# Altium project H7_PCB.PrjPcb (part 2 of 2)

## Sheet Analog.SchDoc
size A3; Author: HamidFijani; DrawnBy: HamidFijani; SheetNumber: 11; SheetTotal: 13
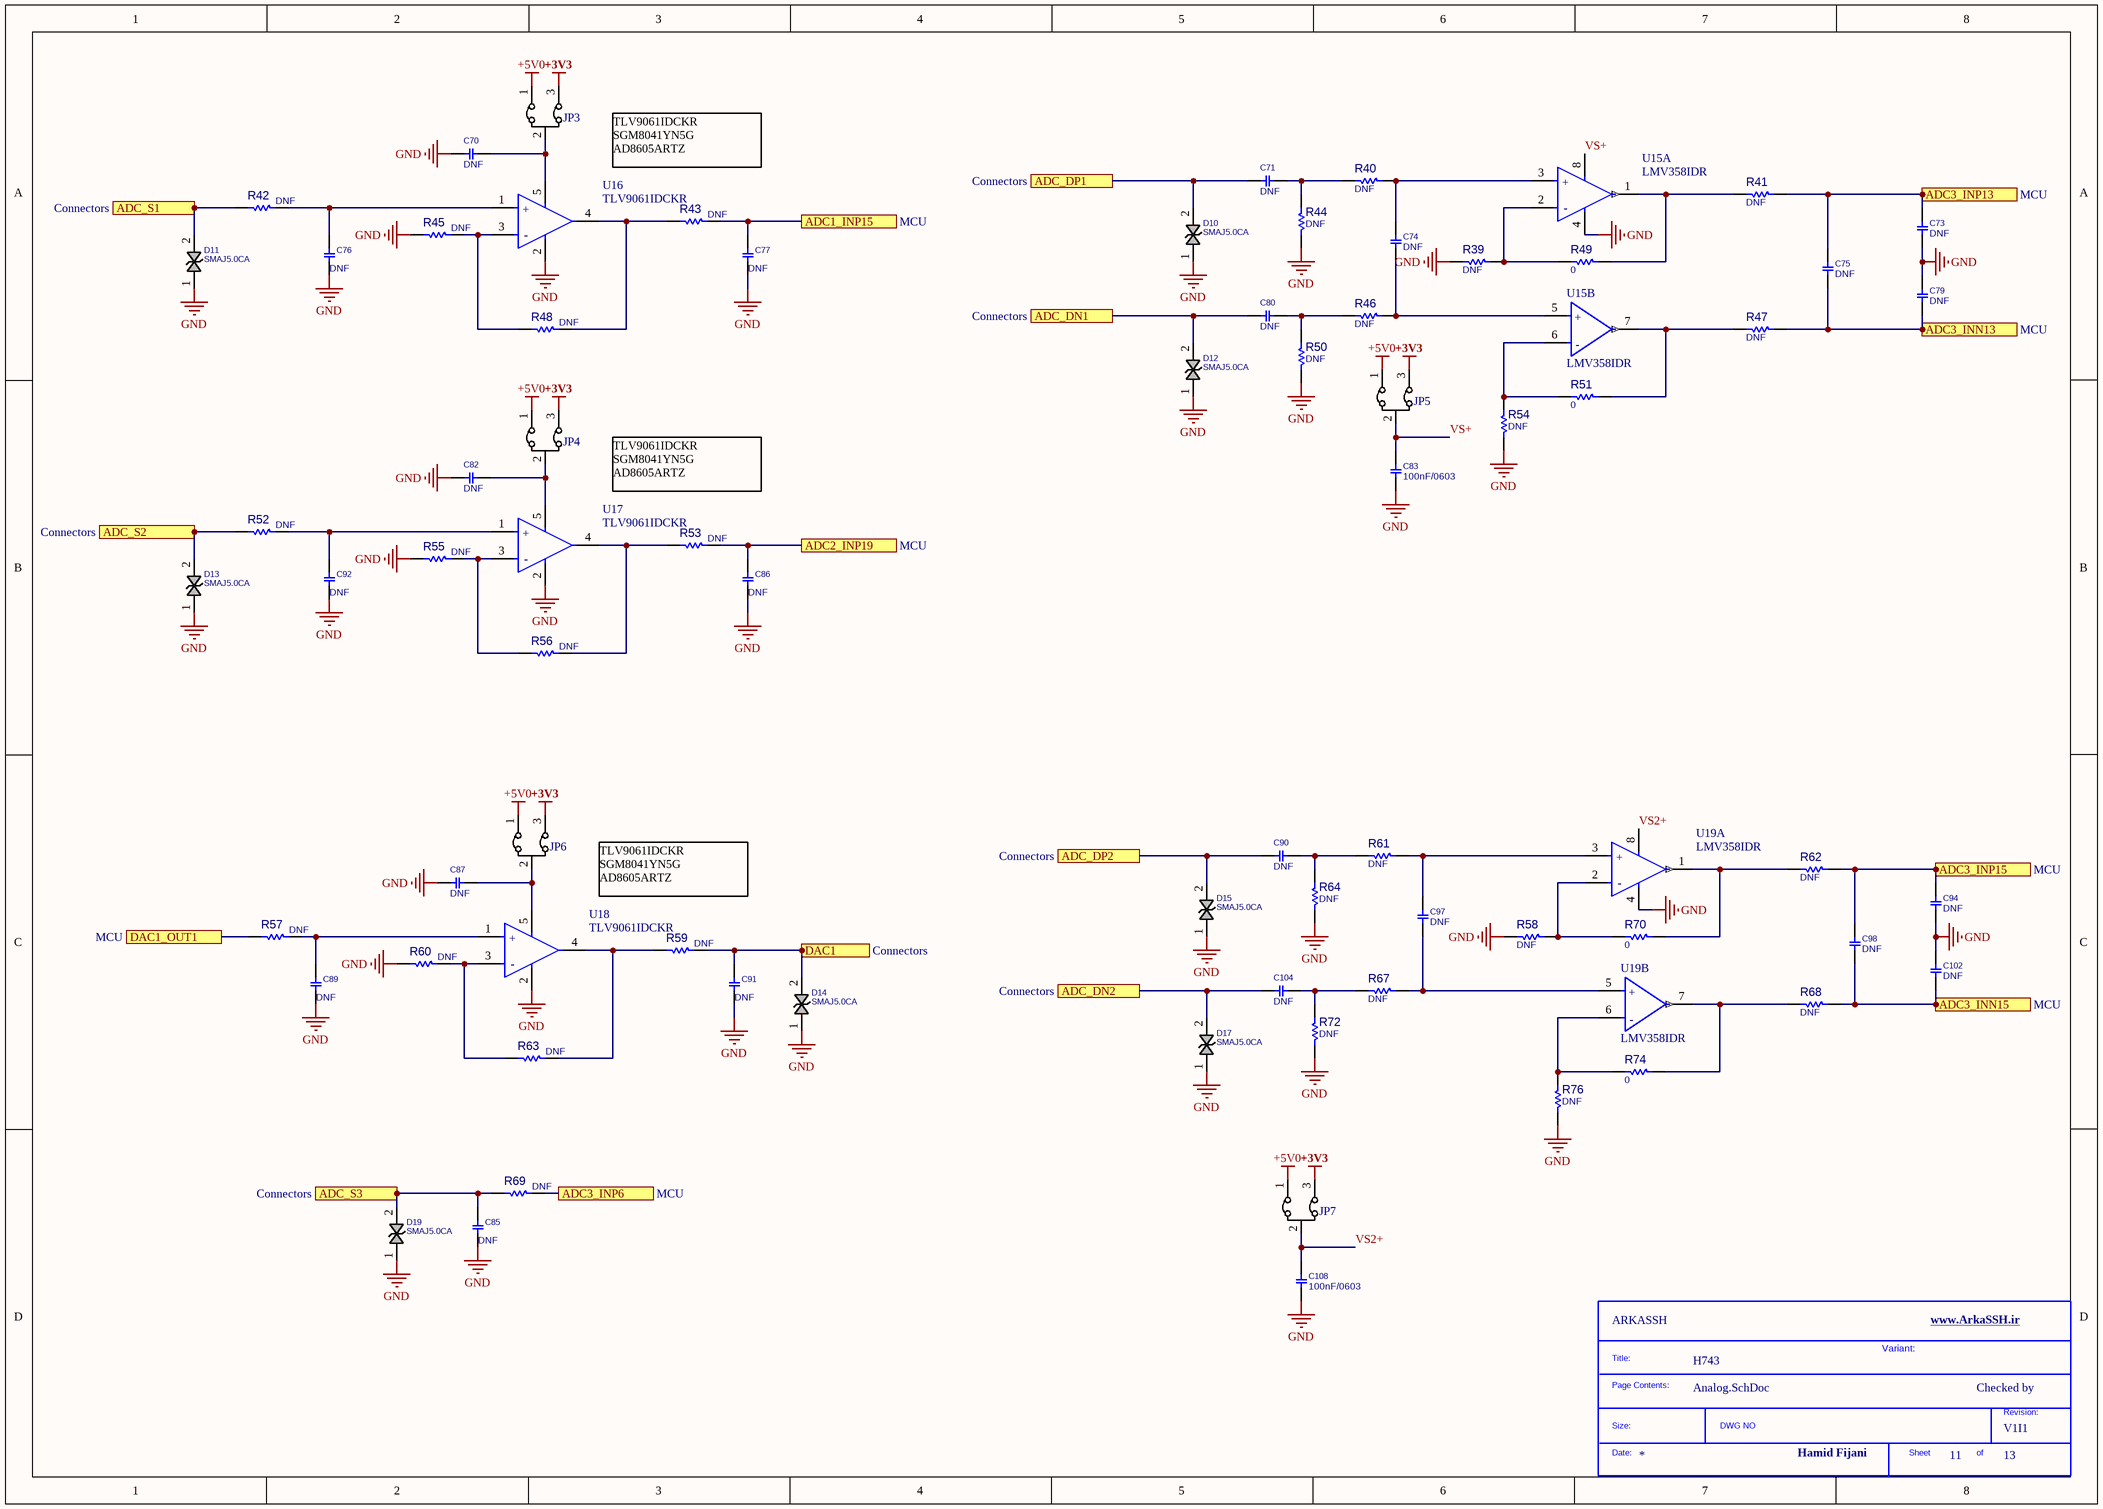
[diagram p11: Analog.SchDoc]

### Parts
(Parts that share a designator on the sheet are numbered #1, #2 ... from top to bottom, then left to right.)
?#7  (no value)  (graphical)
C70  DNF  [C0603]
C71  DNF  [C0603]
C73  DNF  [C0603]
C74  DNF  [C0603]
C75  DNF  [C0603]
C76  DNF  [C0603]
C77  DNF  [C0603]
C79  DNF  [C0603]
C80  DNF  [C0603]
C82  DNF  [C0603]
C83  100nF/0603  [C0603]
C85  DNF  [C0603]
C86  DNF  [C0603]
C87  DNF  [C0603]
C89  DNF  [C0603]
C90  DNF  [C0603]
C91  DNF  [C0603]
C92  DNF  [C0603]
C94  DNF  [C0603]
C97  DNF  [C0603]
C98  DNF  [C0603]
C102  DNF  [C0603]
C104  DNF  [C0603]
C108  100nF/0603  [C0603]
D10  SMAJ5.0CA  [D_SMA]
D11  SMAJ5.0CA  [D_SMA]
D12  SMAJ5.0CA  [D_SMA]
D13  SMAJ5.0CA  [D_SMA]
D14  SMAJ5.0CA  [D_SMA]
D15  SMAJ5.0CA  [D_SMA]
D17  SMAJ5.0CA  [D_SMA]
D19  SMAJ5.0CA  [D_SMA]
JP3  JMPHDR3PIN  [JP_3_40X90]  (value not drawn)  (no BOM)
JP4  JMPHDR3PIN  [JP_3_40X90]  (value not drawn)  (no BOM)
JP5  JMPHDR3PIN  [JP_3_40X90]  (value not drawn)  (no BOM)
JP6  JMPHDR3PIN  [JP_3_40X90]  (value not drawn)  (no BOM)
JP7  JMPHDR3PIN  [JP_3_40X90]  (value not drawn)  (no BOM)
R39  DNF  [R0603]
R40  DNF  [R0603]
R41  DNF  [R0603]
R42  DNF  [R0603]
R43  DNF  [R0603]
R44  DNF  [R0603]
R45  DNF  [R0603]
R46  DNF  [R0603]
R47  DNF  [R0603]
R48  DNF  [R0603]
R49  0  [R0603]
R50  DNF  [R0603]
R51  0  [R0603]
R52  DNF  [R0603]
R53  DNF  [R0603]
R54  DNF  [R0603]
R55  DNF  [R0603]
R56  DNF  [R0603]
R57  DNF  [R0603]
R58  DNF  [R0603]
R59  DNF  [R0603]
R60  DNF  [R0603]
R61  DNF  [R0603]
R62  DNF  [R0603]
R63  DNF  [R0603]
R64  DNF  [R0603]
R67  DNF  [R0603]
R68  DNF  [R0603]
R69  DNF  [R0603]
R70  0  [R0603]
R72  DNF  [R0603]
R74  0  [R0603]
R76  DNF  [R0603]
U15  LMV358IDR  [FP-D0008A-MFG]  (parts A,B of 2)
U16  TLV9061IDCKR  [FP-DCK0005A-MFG]
U17  TLV9061IDCKR  [FP-DCK0005A-MFG]
U18  TLV9061IDCKR  [FP-DCK0005A-MFG]
U19  LMV358IDR  [FP-D0008A-MFG]  (parts A,B of 2)

### Ports
ADC1_INP15 (see MCU), ADC2_INP19 (see MCU), ADC3_INN13 (see MCU), ADC3_INN15 (see MCU), ADC3_INP6 (see MCU), ADC3_INP13 (see MCU), ADC3_INP15 (see MCU), ADC_DN1 (see Connectors), ADC_DN2 (see Connectors), ADC_DP1 (see Connectors), ADC_DP2 (see Connectors), ADC_S1 (see Connectors), ADC_S2 (see Connectors), ADC_S3 (see Connectors), DAC1 (see Connectors), DAC1_OUT1 (see MCU)

### Nets
+3V3: JP3.3 JP4.3 JP5.3 JP6.3 JP7.3
+5V0: JP3.1 JP4.1 JP5.1 JP6.1 JP7.1
GND: C70.2 C73.2 C76.2 C77.2 C79.1 C82.2 C83.2 C85.2 C86.2 C87.2 C89.2 C91.2 C92.2 C94.2 C102.1 C108.2 D10.1 D11.1 D12.1 D13.1 D14.1 D15.1 D17.1 D19.1 R39.2 R44.1 R45.1 R50.1 R54.2 R55.1 R58.2 R60.1 R64.1 R72.1 R76.2 U15.4(GND) U16.2(V-) U17.2(V-) U18.2(V-) U19.4(GND)
VS2+: C108.1 JP7.2 U19.8(VCC+)
VS+: C83.1 JP5.2 U15.8(VCC+)
NetC70_1: C70.1 JP3.2 U16.5(V+)
NetC71_1: C71.1 D10.2 ; port ADC_DP1
NetC71_2: C71.2 R40.1 R44.2
NetC73_1: C73.1 C75.1 R41.2 ; port ADC3_INP13
NetC74_1: C74.1 R40.2 U15.3(1IN+)
NetC74_2: C74.2 R46.2 U15.5(2IN+)
NetC75_2: C75.2 C79.2 R47.2 ; port ADC3_INN13
NetC76_1: C76.1 R42.2 U16.1(IN+)
NetC77_1: C77.1 R43.2 ; port ADC1_INP15
NetC80_1: C80.1 D12.2 ; port ADC_DN1
NetC80_2: C80.2 R46.1 R50.2
NetC82_1: C82.1 JP4.2 U17.5(V+)
NetC85_1: C85.1 D19.2 R69.1 ; port ADC_S3
NetC86_1: C86.1 R53.2 ; port ADC2_INP19
NetC87_1: C87.1 JP6.2 U18.5(V+)
NetC89_1: C89.1 R57.2 U18.1(IN+)
NetC90_1: C90.1 D15.2 ; port ADC_DP2
NetC90_2: C90.2 R61.1 R64.2
NetC91_1: C91.1 D14.2 R59.2 ; port DAC1
NetC92_1: C92.1 R52.2 U17.1(IN+)
NetC94_1: C94.1 C98.1 R62.2 ; port ADC3_INP15
NetC97_1: C97.1 R61.2 U19.3(1IN+)
NetC97_2: C97.2 R67.2 U19.5(2IN+)
NetC98_2: C98.2 C102.2 R68.2 ; port ADC3_INN15
NetC104_1: C104.1 D17.2 ; port ADC_DN2
NetC104_2: C104.2 R67.1 R72.2
NetD11_2: D11.2 R42.1 ; port ADC_S1
NetD13_2: D13.2 R52.1 ; port ADC_S2
NetR39_1: R39.1 R49.2 U15.2(1IN-)
NetR41_1: R41.1 R49.1 U15.1(OUT)
NetR43_1: R43.1 R48.2 U16.4(OUT)
NetR45_2: R45.2 R48.1 U16.3(IN-)
NetR47_1: R47.1 R51.1 U15.7(2OUT)
NetR51_2: R51.2 R54.1 U15.6(2IN-)
NetR53_1: R53.1 R56.2 U17.4(OUT)
NetR55_2: R55.2 R56.1 U17.3(IN-)
NetR57_1: R57.1 ; port DAC1_OUT1
NetR58_1: R58.1 R70.2 U19.2(1IN-)
NetR59_1: R59.1 R63.2 U18.4(OUT)
NetR60_2: R60.2 R63.1 U18.3(IN-)
NetR62_1: R62.1 R70.1 U19.1(OUT)
NetR68_1: R68.1 R74.1 U19.7(2OUT)
NetR69_2: R69.2 ; port ADC3_INP6
NetR74_2: R74.2 R76.1 U19.6(2IN-)

### Notes on the sheet
- TLV9061IDCKR
  SGM8041YN5G
  AD8605ARTZ
- Title:
- Page Contents:
- Variant:
- Checked by
- Size:
- Date:
- DWG NO
- Sheet
- of
- Revision:
- (in symbol CMP-04895-000108-1) +; -
- (in symbol CMP-04895-000136-1, part A) +; -
- (in symbol CMP-04895-000136-1, part B) +; -

### Library data of the parts
?#7 = SDTitleBlock
C70 C71 C73-C77 C79 C80 C82 C83 C85-C87 C89-C92 C94 C97 C98 C102 C104 C108 = CAP_SMD_MLCC_0603: CAP, MLCC; PARAM: -, -%; MANF_P#: MANF_PART#; PARAM2: -V; PRICE: 100= 1$; MANF: -; ASSEMBLY: ASSEMBLY
  C70 C71 C73-C77 C79 C80 C82 C85-C87 C89-C92 C94 C97 C98 C102 C104: VALUE: DNF
  C83 C108: VALUE: 100nF/0603
D10-D15 D17 D19 = TVS_SMAJ5CA: TVS, ESD PROTECT, Bidirectional; MANF: Littelfuse; PARAM2: 5VR, 6.74VBR; PARAM: -65~150°C; MANF_P#: SMAJ5CA; PRICE: 0.5t@Paya; VALUE: SMAJ5.0CA
JP3-JP7 = JUMPER_SOLDER_3P: JUMPER, HEADER 3PIN; MANF: MANF; MANF_P#: MANF_P#; VALUE: JMPHDR3PIN
R39-R64 R67-R70 R72 R74 R76 = RES_SMD_0603: RESISTOR, SMD; PARAM: 1%, 0.1W; DESC: DESCRIPTION; DIST#: MOUSER; MANF_P#: -; MANF: -; ASSEMBLY: ASSEMBLY; PRICE: -; PARAM2: -
  R39-R48 R50 R52-R64 R67-R69 R72 R76: VALUE: DNF
  R49 R51 R70 R74: VALUE: 0
U15 U19 = CMP-04895-000136-1: IC OPAMP GP 2 CIRCUIT 8SOIC; Number of Elements: 2; Min Supply Voltage: 2.7V; Input Bias Current: 250nA; Output Current per Channel: 160mA; Bandwidth: 1MHz; Voltage Gain: 100dB; Input Offset Voltage (Vos): 7mV; Slew Rate: 1V/µs; Nominal Supply Current: 440uA; Power Supply Rejection Ratio (PSRR): 50dB; Max Supply Voltage: 5.5V; Operating Supply Current: 210uA; Lead Free: Lead Free; Length: 4.9mm; RoHS Compliant: Yes; REACH SVHC: No SVHC; Case/Package: SOIC; Height: 1.58mm; Number of Channels: 2; Number of Amplifiers: 2; Radiation Hardening: No; Number of Circuits: 2; Mount: Surface Mount; Contact Plating: Gold; Unity Gain Bandwidth Product: 1MHz; Min Operating Temperature: -40°C; Max Operating Temperature: 125°C; Width: 3.91mm; Gain Bandwidth Product: 1MHz; Number of Pins: 8; Packaging: Tape and Reel; Package Quantity: 2500; Output Current: 160mA; Common Mode Rejection Ratio: 50dB
U16-U18 = CMP-04895-000108-1: IC CMOS 1 CIRCUIT SC70-5; RoHS Compliant: Yes

## Sheet Connectors.SchDoc
size A3; Author: HamidFijani; DrawnBy: HamidFijani; SheetNumber: 12; SheetTotal: 13
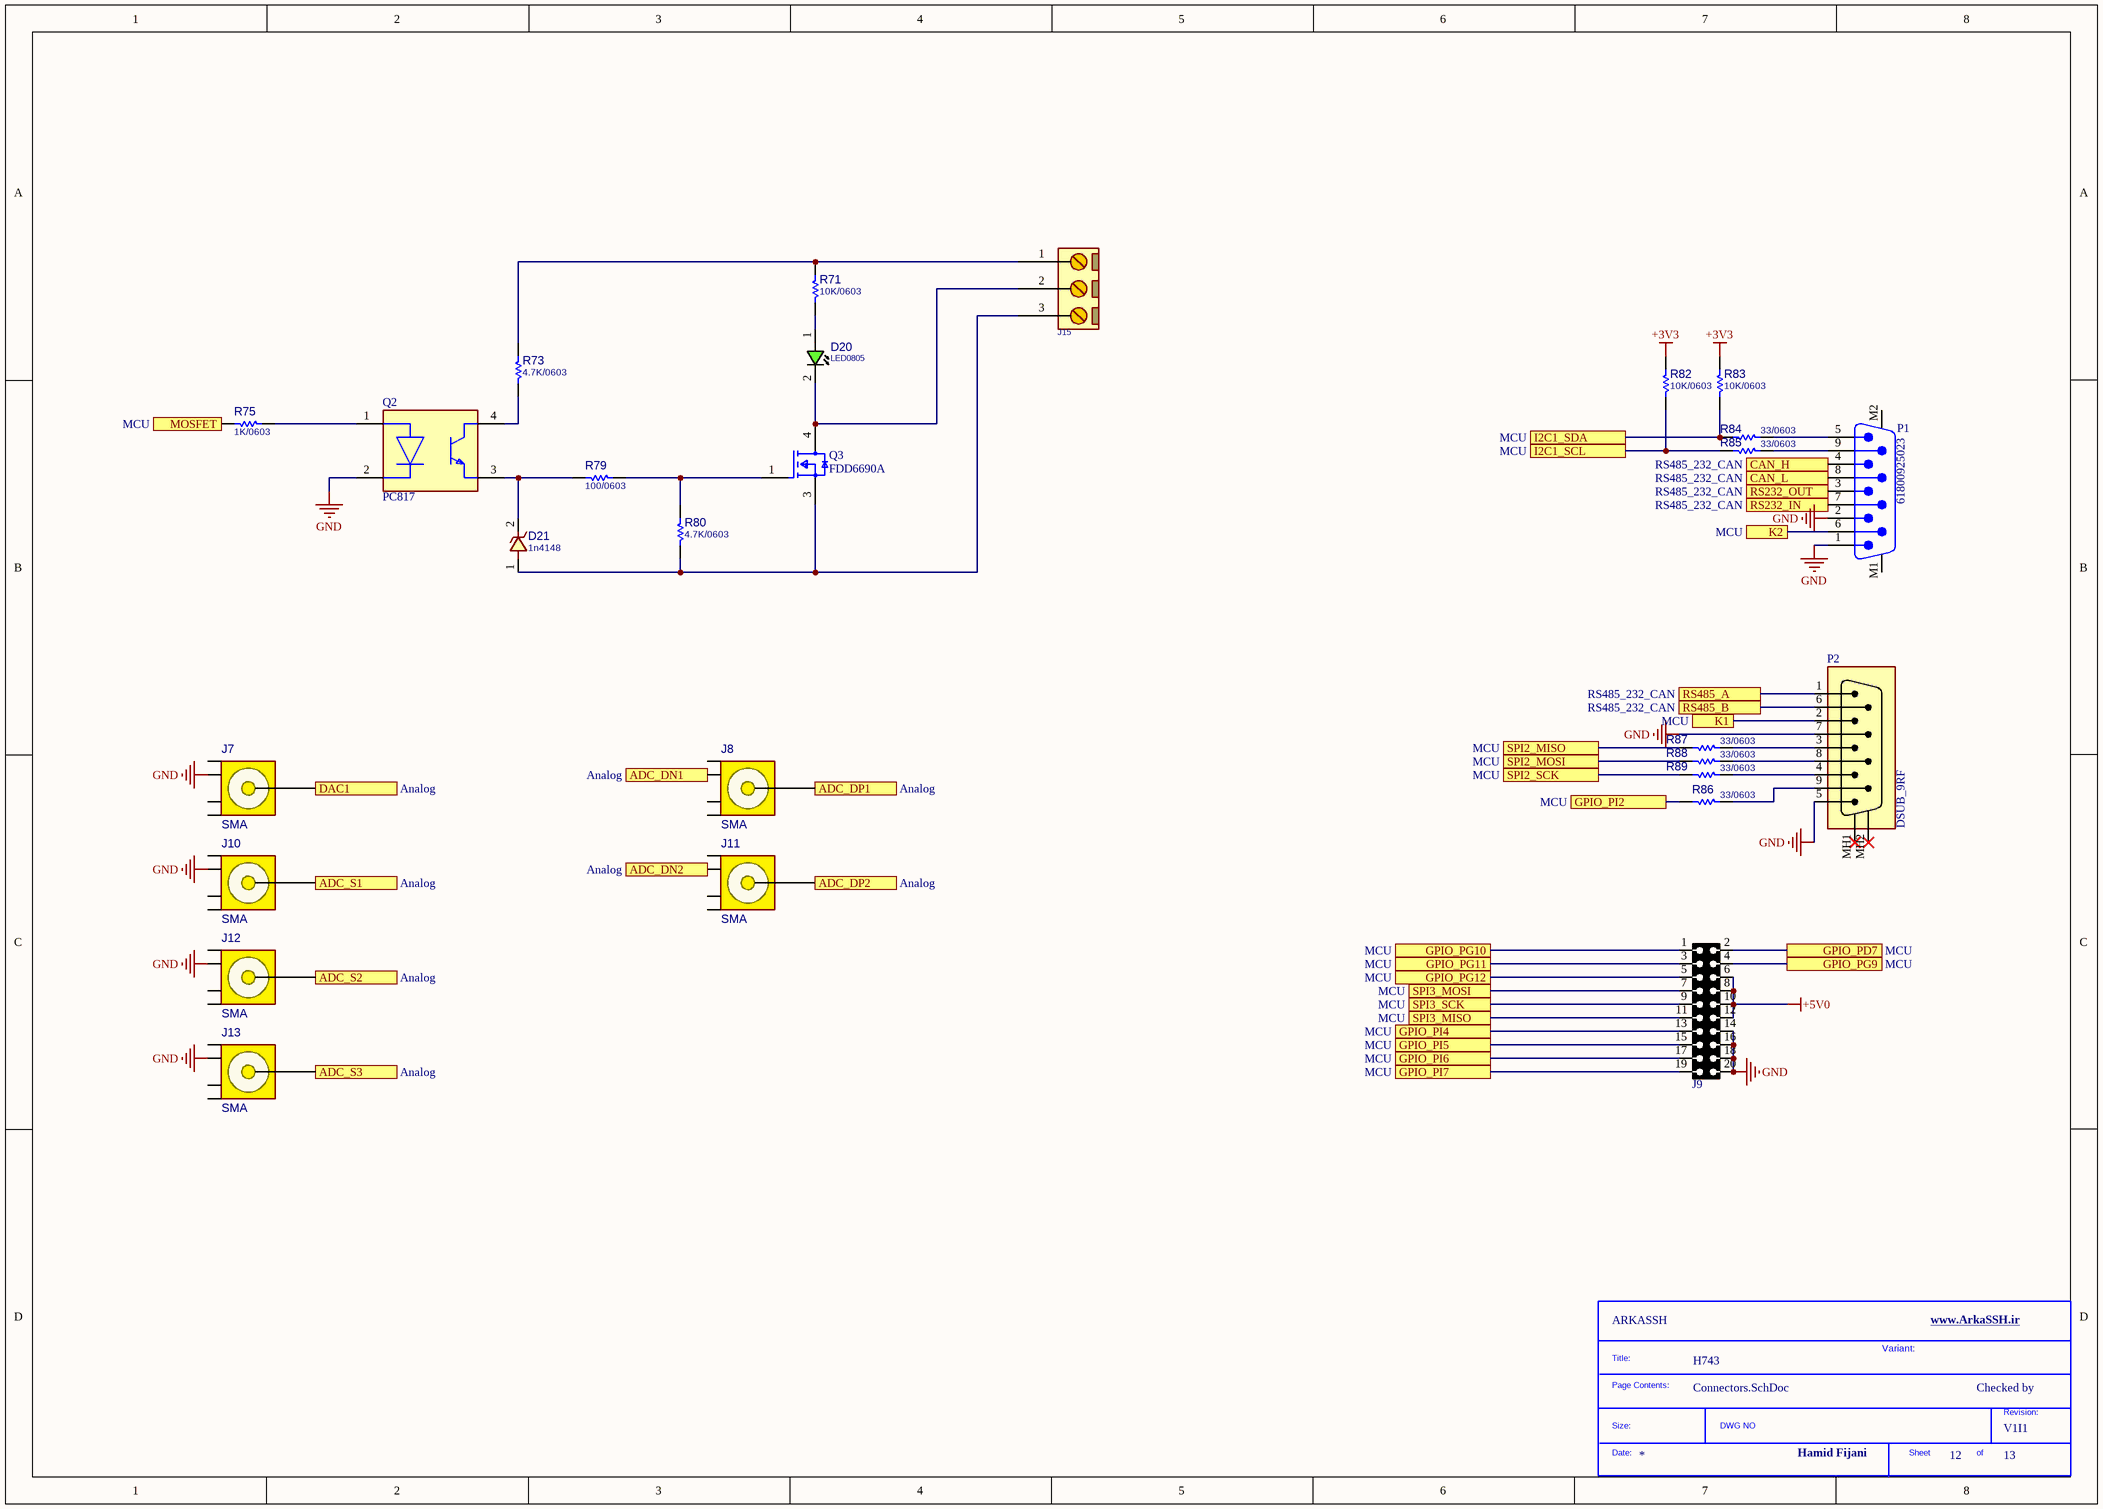
[diagram p12: Connectors.SchDoc]

### Parts
(Parts that share a designator on the sheet are numbered #1, #2 ... from top to bottom, then left to right.)
?#8  (no value)  (graphical)
D20  LED0805  [LED0805]
D21  1n4148  [D_SOD123W]
J7  SMA  [SMA_RA]
J8  SMA  [SMA_ST]
J9  HDRMINI_2X10  [HDRMINI_F_2X10]  (value not drawn)
J10  SMA  [SMA_RA]
J11  SMA  [SMA_RA]
J12  SMA  [SMA_ST]
J13  SMA  [SMA_ST]
J15  CONN_TB3  [MSTB_3]  (value not drawn)
P1  61800925023  [61800925023]
P2  DSUB_9RF  [DSUB_9RF]
Q2  PC817  [FP-PC817XNNIP0F-MFG]
Q3  FDD6690A  [FP-369AS-MFG]
R71  10K/0603  [R0603]
R73  4.7K/0603  [R0603]
R75  1K/0603  [R0603]
R79  100/0603  [R0603]
R80  4.7K/0603  [R0603]
R82  10K/0603  [R0603]
R83  10K/0603  [R0603]
R84  33/0603  [R0603]
R85  33/0603  [R0603]
R86  33/0603  [R0603]
R87  33/0603  [R0603]
R88  33/0603  [R0603]
R89  33/0603  [R0603]

### Ports
ADC_DN1 (see Analog), ADC_DN2 (see Analog), ADC_DP1 (see Analog), ADC_DP2 (see Analog), ADC_S1 (see Analog), ADC_S2 (see Analog), ADC_S3 (see Analog), CAN_H (see RS485_232_CAN), CAN_L (see RS485_232_CAN), DAC1 (see Analog), GPIO_PD7 (see MCU), GPIO_PG9 (see MCU), GPIO_PG10 (see MCU), GPIO_PG11 (see MCU), GPIO_PG12 (see MCU), GPIO_PI2 (see MCU), GPIO_PI4 (see MCU), GPIO_PI5 (see MCU), GPIO_PI6 (see MCU), GPIO_PI7 (see MCU), I2C1_SCL (see MCU), I2C1_SDA (see MCU), K1 (see MCU), K2 (see MCU), MOSFET (see MCU), RS232_IN (see RS485_232_CAN), RS232_OUT (see RS485_232_CAN), RS485_A (see RS485_232_CAN), RS485_B (see RS485_232_CAN), SPI2_MISO (see MCU), SPI2_MOSI (see MCU), SPI2_SCK (see MCU), SPI3_MISO (see MCU), SPI3_MOSI (see MCU), SPI3_SCK (see MCU)

### Nets
+3V3: R82.1 R83.1
+5V0: J9.6 J9.8 J9.10 J9.12
GND: J7.3(G2) J9.14 J9.16 J9.18 J9.20 J10.3(G2) J12.3(G2) J13.3(G2) P1.1 P1.2 P2.5 P2.7 Q2.2(C)
NetC71_1: J8.1(SIG) ; port ADC_DP1
NetC80_1: J8.3(G2) ; port ADC_DN1
NetC85_1: J13.1(SIG) ; port ADC_S3
NetC90_1: J11.1(SIG) ; port ADC_DP2
NetC91_1: J7.1(SIG) ; port DAC1
NetC104_1: J11.3(G2) ; port ADC_DN2
NetC111_2: P1.6 ; port K2
NetC112_2: P2.2 ; port K1
NetD6_1: P1.3 ; port RS232_OUT
NetD6_2: P1.7 ; port RS232_IN
NetD9_1: P1.4 ; port CAN_H
NetD9_2: P1.8 ; port CAN_L
NetD11_2: J10.1(SIG) ; port ADC_S1
NetD13_2: J12.1(SIG) ; port ADC_S2
NetD20_1: D20.1(ANODE) R71.2
NetD20_2: D20.2(CATHODE) J15.2 Q3.4(D)
NetD21_1: D21.1 J15.3 Q3.3(S) R80.2
NetD21_2: D21.2 Q2.3(E) R79.2
NetJ9_1: J9.1 ; port GPIO_PG10
NetJ9_2: J9.2 ; port GPIO_PD7
NetJ9_3: J9.3 ; port GPIO_PG11
NetJ9_4: J9.4 ; port GPIO_PG9
NetJ9_5: J9.5 ; port GPIO_PG12
NetJ9_7: J9.7 ; port SPI3_MOSI
NetJ9_9: J9.9 ; port SPI3_SCK
NetJ9_11: J9.11 ; port SPI3_MISO
NetJ9_13: J9.13 ; port GPIO_PI4
NetJ9_15: J9.15 ; port GPIO_PI5
NetJ9_17: J9.17 ; port GPIO_PI6
NetJ9_19: J9.19 ; port GPIO_PI7
NetJ15_1: J15.1 R71.1 R73.1
NetP1_5: P1.5 R84.2
NetP1_9: P1.9 R85.2
NetP2_1: P2.1 ; port RS485_A
NetP2_3: P2.3 R87.2
NetP2_4: P2.4 R89.2
NetP2_6: P2.6 ; port RS485_B
NetP2_8: P2.8 R88.2
NetP2_9: P2.9 R86.2
NetQ2_1: Q2.1(A) R75.1
NetQ2_4: Q2.4(C) R73.2
NetQ3_1: Q3.1(G) R79.1 R80.1
NetR75_2: R75.2 ; port MOSFET
NetR82_2: R82.2 R85.1 ; port I2C1_SCL
NetR83_2: R83.2 R84.1 ; port I2C1_SDA
NetR86_1: R86.1 ; port GPIO_PI2
NetR87_1: R87.1 ; port SPI2_MISO
NetR88_1: R88.1 ; port SPI2_MOSI
NetR89_1: R89.1 ; port SPI2_SCK

Not connected (* = marked no-connect by the designer): J7 2(G1) 4(G3) 5(G4); J8 2(G1) 4(G3) 5(G4); J10 2(G1) 4(G3) 5(G4); J11 2(G1) 4(G3) 5(G4); J12 2(G1) 4(G3) 5(G4); J13 2(G1) 4(G3) 5(G4); P1 M1 M2; P2 MH1* MH2*

### Notes on the sheet
- Title:
- Page Contents:
- Variant:
- Checked by
- Size:
- Date:
- DWG NO
- Sheet
- of
- Revision:

### Library data of the parts
?#8 = SDTitleBlock
D20 = LED_SMD_0805: LED, SMD, 0805; DESC: DESCRIPTION; MANF_P#: MANF_PART#; PARAM2: 2.2V; MANF: MANF; ASSEMBLY: ASSEMBLY; PRICE: PRICE; VALUE: LED0805
D21 = DIODE_SMD_ZENER_DFLZ5V6: DIODE, ZENER, 1W, 5.1V; MANF: Diodes; DESC: DESCRIPTION; PARAM2: 1W, 4Ohm, -55~150oC; PARAM: 5.6V; MANF_P#: DFLZ5V6-7; ASSEMBLY: ASSEMBLY; PRICE: 0.5$; VALUE: 1n4148
J7 J10 J11 = CONN_RF_SMA_RA: CONN, RF, SMA, Right Angle; MANF_P#: SMA-J-P-H-RA-TH1; MANF: Samtec; PARAM: 50Ohm, 20GHz; DESC: DESCRIPTION; DIST#: DIGIKEY; PARAM2: GOLD; ASSEMBLY: ASSEMBLY; PRICE: 6.3$; VALUE: SMA
J8 J12 J13 = CONN_RF_SMA_ST: CONN, RF, SMA, STRAIGHT; MANF_P#: 142-0701-201; MANF: Johnson; PARAM: 50Ohm, 18GHz; DESC: DESCRIPTION; DIST#: MOUSER; PARAM2: GOLD; ASSEMBLY: ASSEMBLY; PRICE: 2.7$; VALUE: SMA
J9 = HDRMINI_F_2X10: CONN, HEADER, Female, pitch: 1.27mm,; VALUE: HDRMINI_2X10
J15 = CONN_MSTB_3: CONN, PHOENIX MSTB, 5-G, 5.08mm pitch; PARAM2: 320V; PARAM: 12A; VALUE: CONN_TB3
P1 = CMP-1502-00276-2: NexarPartId: 18818192; Pitch: 2.84mm; Current Rating: 3A; Operating Supply Voltage: 125V; Insulation Resistance: 5GΩ; Number of Contacts: 9; Gender: Male; Contact Resistance: 30mΩ; Connector Type: D-Sub; REACH SVHC: Unknown; Min Operating Temperature: -40°C; Mount: Through Hole; Width: 12.5mm; Number of Rows: 2; Number of Pins: 9; RoHS: Compliant; Housing Material: Steel; Depth: 10.9mm; Orientation: Vertical; Contact Plating: Gold; Length: 30.81mm; Insulation Material: PBT; Max Operating Temperature: 85°C; Voltage Rating: 125V; Termination: SMD/SMT
P2 = CONN_DSUB_9RF: CONN, DSUB, HD, 9PIN, R/A, FEMALE, THD; MANF_P#: -; MANF: -; VALUE: DSUB_9RF
Q2 = CMP-65434-000005-1: OPTOISOLATOR 5KV TRANS 4SMD; Reverse Breakdown Voltage: 6V; Output Current per Channel: 30mA; Power Dissipation: 200mW; Collector-emitter Voltage-Max: 200mV; Max Output Voltage: 80V; Input Current: 50mA; Forward Voltage: 1.4V; Fall Time: 18000ns; Number of Elements: 1; Input Type: DC; Packaging: Tape and Reel; RoHS Compliant: Yes; Contact Plating: Copper; Min Operating Temperature: -30°C; Collector Emitter Saturation Voltage: 200mV; Max Input Current: 50mA; Radiation Hardening: No; Max Collector Current: 50mA; Case/Package: SMD/SMT; Mount: Surface Mount; Output Voltage: 80V; Forward Current: 50mA; Max Power Dissipation: 200mW; Collector Emitter Voltage (VCEO): 80V; Number of Channels: 1; Rise Time: 18000ns; Isolation Voltage: 5kV; Number of Pins: 4; Lead Free: Lead Free; Package Quantity: 2000; Isolation Voltage-Max: 5kV; Max Operating Temperature: 100°C
Q3 = CMP-00278-84325831-1: FDD6690A N-Channel PowerTrench® MOSFET, 30V, 46A, 12mΩ; Manufacturer Lifecycle Status: LAST SHIPMENTS; Turn-Off Delay Time: 29ns; Turn-On Delay Time: 10ns; Input Capacitance: 1.23nF; Nominal Vgs: 1.9V; Rise Time: 7ns; Element Configuration: Single; Power Dissipation: 3.3W; Fall Time: 12ns; Gate to Source Voltage (Vgs): 20V; Number of Elements: 1; Max Power Dissipation: 1.5W; Drain to Source Breakdown Voltage: 30V; Lifecycle Status: EOL; NexarPartId: 84325831; Weight: 260.37mg; Mount: Surface Mount; Number of Pins: 3; Rds On Max: 12mΩ; Radiation Hardening: No; Threshold Voltage: 1.9V; Min Operating Temperature: -55°C; Max Operating Temperature: 175°C; Resistance: 12MΩ; Voltage Rating (DC): 30V; REACH SVHC: No SVHC; Case/Package: TO-252; Width: 6.22mm; Current Rating: 46A; Length: 6.73mm; Height: 2.39mm; RoHS: Compliant; Drain to Source Voltage (Vdss): 30V; Lead Free: Lead Free; Packaging: Cut Tape; Drain to Source Resistance: 12mΩ; Continuous Drain Current (ID): 46A; Dual Supply Voltage: 30V
R71 R73 R75 R79 R80 R82-R89 = RES_SMD_0603: as R39 on sheet Analog; MANF_P#: -; MANF: -; ASSEMBLY: ASSEMBLY; PRICE: -; PARAM2: -
  R71 R82 R83: VALUE: 10K/0603
  R73 R80: VALUE: 4.7K/0603
  R75: VALUE: 1K/0603
  R79: VALUE: 100/0603
  R84-R89: VALUE: 33/0603

## Nets that join several sheets
+3V3: MCU (35 pins), Designator (6 pins), Designator (6 pins), MEMORY (14 pins), LAN (9 pins), SDCARD (9 pins), RS485_232_CAN (6 pins), Analog (5 pins), Connectors (R82.1 R83.1)
+5V0: MCU (C30.2 U2.3 U2.4), Designator (6 pins), Designator (6 pins), USB (F2.1 R28.1), RS485_232_CAN (JP1.1 JP2.1), Analog (5 pins), Connectors (J9.6 J9.8 J9.10 J9.12)
+VIN: Designator (D1_Designator#1.1 J14_Designator#1.2), Designator (D1_Designator#2.1 J14_Designator#2.2)
ETH_GND: LAN (J2.8 J2.SH1 J2.SH2), USB (J4.Shell J5.Shell)
GND: MCU (51 pins), Designator (10 pins), Designator (10 pins), MEMORY (15 pins), LAN (18 pins), SDCARD (7 pins), USB (13 pins), RS485_232_CAN (15 pins), Analog (40 pins), Connectors (13 pins)
DUSB1_N: MCU (U1.122), USB (L4.1)
DUSB1_P: MCU (U1.123), USB (L4.4)
NetC71_1: Analog (C71.1 D10.2), Connectors (J8.1)
NetC73_1: MCU (U1.43), Analog (C73.1 C75.1 R41.2)
NetC75_2: MCU (U1.44), Analog (C75.2 C79.2 R47.2)
NetC77_1: MCU (U1.47), Analog (C77.1 R43.2)
NetC80_1: Analog (C80.1 D12.2), Connectors (J8.3)
NetC85_1: Analog (C85.1 D19.2 R69.1), Connectors (J13.1)
NetC86_1: MCU (U1.51), Analog (C86.1 R53.2)
NetC90_1: Analog (C90.1 D15.2), Connectors (J11.1)
NetC91_1: Analog (C91.1 D14.2 R59.2), Connectors (J7.1)
NetC94_1: MCU (U1.45), Analog (C94.1 C98.1 R62.2)
NetC98_2: MCU (U1.46), Analog (C98.2 C102.2 R68.2)
NetC104_1: Analog (C104.1 D17.2), Connectors (J11.3)
NetC111_2: MCU (C111.2 R65.2 R77.1 SW1.2), Connectors (P1.6)
NetC112_2: MCU (C112.2 R66.2 R78.1 SW2.2), Connectors (P2.2)
NetD6_1: RS485_232_CAN (D6.1 D8.2 U13.7), Connectors (P1.3)
NetD6_2: RS485_232_CAN (D6.2 D7.2 U13.8), Connectors (P1.7)
NetD9_1: RS485_232_CAN (D9.1 R38.2 U14.7), Connectors (P1.4)
NetD9_2: RS485_232_CAN (D9.2 R38.1 U14.6), Connectors (P1.8)
NetD11_2: Analog (D11.2 R42.1), Connectors (J10.1)
NetD13_2: Analog (D13.2 R52.1), Connectors (J12.1)
NetJ9_1: MCU (U1.153), Connectors (J9.1)
NetJ9_2: MCU (U1.151), Connectors (J9.2)
NetJ9_3: MCU (U1.154), Connectors (J9.3)
NetJ9_4: MCU (U1.152), Connectors (J9.4)
NetJ9_5: MCU (U1.155), Connectors (J9.5)
NetJ9_7: MCU (U1.150), Connectors (J9.7)
NetJ9_9: MCU (U1.161), Connectors (J9.9)
NetJ9_11: MCU (U1.162), Connectors (J9.11)
NetJ9_13: MCU (U1.173), Connectors (J9.13)
NetJ9_15: MCU (U1.174), Connectors (J9.15)
NetJ9_17: MCU (U1.175), Connectors (J9.17)
NetJ9_19: MCU (U1.176), Connectors (J9.19)
NetP2_1: RS485_232_CAN (R33.2 R35.1 U11.6 U12.2), Connectors (P2.1)
NetP2_6: RS485_232_CAN (R35.2 R37.1 U11.7 U12.1), Connectors (P2.6)
NetR8_2: MCU (U1.79), LAN (R8.2 U3.15)
NetR9_1: MCU (U1.42), LAN (R9.1)
NetR27_2: MCU (U1.34), MEMORY (R27.2 U6.19)
NetR29_1: MCU (U1.57), USB (R29.1)
NetR31_2: MCU (U1.121), USB (R31.2)
NetR32_2: MCU (U1.120), USB (R32.2)
NetR34_2: MCU (U1.116), RS485_232_CAN (R34.2 U11.1)
NetR36_2: MCU (U1.119), RS485_232_CAN (R36.2 U11.2 U11.3)
NetR57_1: MCU (U1.50), Analog (R57.1)
NetR69_2: MCU (U1.28), Analog (R69.2)
NetR75_2: MCU (U1.89), Connectors (R75.2)
NetR82_2: MCU (U1.167), Connectors (R82.2 R85.1)
NetR83_2: MCU (U1.165), Connectors (R83.2 R84.1)
NetR86_1: MCU (U1.133), Connectors (R86.1)
NetR87_1: MCU (U1.94), Connectors (R87.1)
NetR88_1: MCU (U1.95), Connectors (R88.1)
NetR89_1: MCU (U1.132), Connectors (R89.1)
NetU1_16: MCU (U1.16), MEMORY (U6.23)
NetU1_17: MCU (U1.17), MEMORY (U6.24)
NetU1_18: MCU (U1.18), MEMORY (U6.25)
NetU1_19: MCU (U1.19), MEMORY (U6.26)
NetU1_20: MCU (U1.20), MEMORY (U6.29)
NetU1_21: MCU (U1.21), MEMORY (U6.30)
NetU1_24: MCU (U1.24), MEMORY (U7.7)
NetU1_25: MCU (U1.25), MEMORY (U7.3)
NetU1_26: MCU (U1.26), MEMORY (U7.5)
NetU1_27: MCU (U1.27), MEMORY (U7.2)
NetU1_32: MCU (U1.32), MEMORY (U6.16)
NetU1_33: MCU (U1.33), LAN (U3.13)
NetU1_35: MCU (U1.35), MEMORY (U6.37)
NetU1_58: MCU (U1.58), MEMORY (U7.6)
NetU1_59: MCU (U1.59), MEMORY (U6.18)
NetU1_60: MCU (U1.60), MEMORY (U6.31)
NetU1_63: MCU (U1.63), MEMORY (U6.32)
NetU1_64: MCU (U1.64), MEMORY (U6.33)
NetU1_65: MCU (U1.65), MEMORY (U6.34)
NetU1_66: MCU (U1.66), MEMORY (U6.22)
NetU1_67: MCU (U1.67), MEMORY (U6.35)
NetU1_68: MCU (U1.68), MEMORY (U6.8)
NetU1_69: MCU (U1.69), MEMORY (U6.10)
NetU1_70: MCU (U1.70), MEMORY (U6.11)
NetU1_73: MCU (U1.73), MEMORY (U6.13)
NetU1_74: MCU (U1.74), MEMORY (U6.42)
NetU1_75: MCU (U1.75), MEMORY (U6.44)
NetU1_76: MCU (U1.76), MEMORY (U6.45)
NetU1_77: MCU (U1.77), MEMORY (U6.47)
NetU1_78: MCU (U1.78), MEMORY (U6.48)
NetU1_92: MCU (U1.92), RS485_232_CAN (U14.4)
NetU1_93: MCU (U1.93), RS485_232_CAN (U14.1)
NetU1_96: MCU (U1.96), MEMORY (U6.50)
NetU1_97: MCU (U1.97), MEMORY (U6.51)
NetU1_98: MCU (U1.98), MEMORY (U6.53)
NetU1_104: MCU (U1.104), MEMORY (U6.2)
NetU1_105: MCU (U1.105), MEMORY (U6.4)
NetU1_106: MCU (U1.106), MEMORY (U6.36)
NetU1_108: MCU (U1.108), MEMORY (U6.20)
NetU1_109: MCU (U1.109), MEMORY (U6.21)
NetU1_112: MCU (U1.112), MEMORY (U6.38)
NetU1_115: MCU (U1.115), RS485_232_CAN (U11.4)
NetU1_128: MCU (U1.128), RS485_232_CAN (U13.10)
NetU1_129: MCU (U1.129), RS485_232_CAN (U13.9)
NetU1_142: MCU (U1.142), MEMORY (U6.5)
NetU1_143: MCU (U1.143), MEMORY (U6.7)
NetU1_160: MCU (U1.160), MEMORY (U6.17)
NetU1_164: MCU (U1.164), MEMORY (U7.1)
NetU1_169: MCU (U1.169), MEMORY (U6.15)
NetU1_170: MCU (U1.170), MEMORY (U6.39)
RMII_CRS_DV: MCU (U1.53), LAN (RA1.2 U3.11)
RMII_REF_CLK: MCU (U1.41), LAN (R81.1 RA1.1)
RMII_RXD0: MCU (U1.54), LAN (RA1.3 U3.8)
RMII_RXD1: MCU (U1.55), LAN (RA1.4 U3.7)
RMII_TX_EN: MCU (U1.80), LAN (U3.16)
RMII_TXD0: MCU (U1.156), LAN (U3.17)
RMII_TXD1: MCU (U1.157), LAN (U3.18)
SD_CMD: MCU (U1.144), SDCARD (R26.1)
SD_D0: MCU (U1.117), SDCARD (R22.1)
SD_D1: MCU (U1.118), SDCARD (R23.1)
SD_D2: MCU (U1.139), SDCARD (R24.1)
SD_D3: MCU (U1.140), SDCARD (R21.1)
SD_SCK: MCU (U1.141), SDCARD (R25.1)